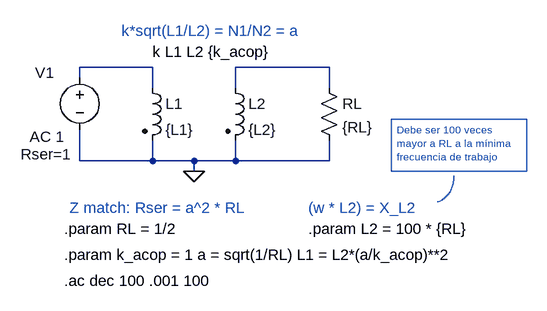
[diagram p0: schematic trafo ideal.asc]
trafo ideal.asc, the LTspice schematic file:
Version 4
SHEET 1 1176 680
WIRE 112 96 0 96
WIRE 384 96 240 96
WIRE 0 112 0 96
WIRE 112 128 112 96
WIRE 240 128 240 96
WIRE 384 128 384 96
WIRE 0 240 0 192
WIRE 112 240 112 208
WIRE 112 240 0 240
WIRE 176 240 112 240
WIRE 240 240 240 208
WIRE 240 240 176 240
WIRE 384 240 384 208
WIRE 384 240 240 240
WIRE 176 256 176 240
FLAG 176 256 0
SYMBOL ind2 96 112 R0
SYMATTR InstName L1
SYMATTR Value {L1}
SYMATTR Type ind
SYMBOL ind2 224 112 R0
SYMATTR InstName L2
SYMATTR Value {L2}
SYMATTR Type ind
SYMBOL voltage 0 96 R0
WINDOW 0 -69 8 Left 2
WINDOW 123 -77 107 Left 2
WINDOW 39 -91 134 Left 2
SYMATTR InstName V1
SYMATTR Value2 AC 1
SYMATTR SpiceLine Rser=1
SYMATTR Value ""
SYMBOL res 368 112 R0
SYMATTR InstName RL
SYMATTR Value {RL}
TEXT 112 72 Left 2 !k L1 L2 {k_acop}
TEXT 64 40 Left 2 ;k*sqrt(L1/L2) = N1/N2 = a
TEXT -24 384 Left 2 !.param k_acop = 1 a = sqrt(1/RL) L1 = L2*(a/k_acop)**2
TEXT -16 312 Left 2 ;Z match: Rser = a^2 * RL
TEXT -24 344 Left 2 !.param RL = 1/2
TEXT -24 424 Left 2 !.ac dec 100 .001 100
TEXT 352 344 Left 2 !.param L2 = 100 * {RL}
TEXT 352 312 Left 2 ;(w * L2) = X_L2
TEXT 488 192 Left 1 ;Debe ser 100 veces \nmayor a RL a la mínima \nfrecuencia de trabajo
RECTANGLE Normal 688 256 480 176
ARC Normal 576 304 512 224 545 270 581 263

The netlist it stands for:
* trafo ideal.asc
L1 N001 0 {L1}
L2 N002 0 {L2}
V1 N001 0 AC 1 Rser=1
RL N002 0 {RL}
k L1 L2 {k_acop}
* k*sqrt(L1/L2) = N1/N2 = a
.param k_acop = 1 a = sqrt(1/RL) L1 = L2*(a/k_acop)**2
* Z match: Rser = a^2 * RL
.param RL = 1/2
.ac dec 100 .001 100
.param L2 = 100 * {RL}
* (w * L2) = X_L2
* Debe ser 100 veces
* mayor a RL a la mínima
* frecuencia de trabajo
.backanno
.end